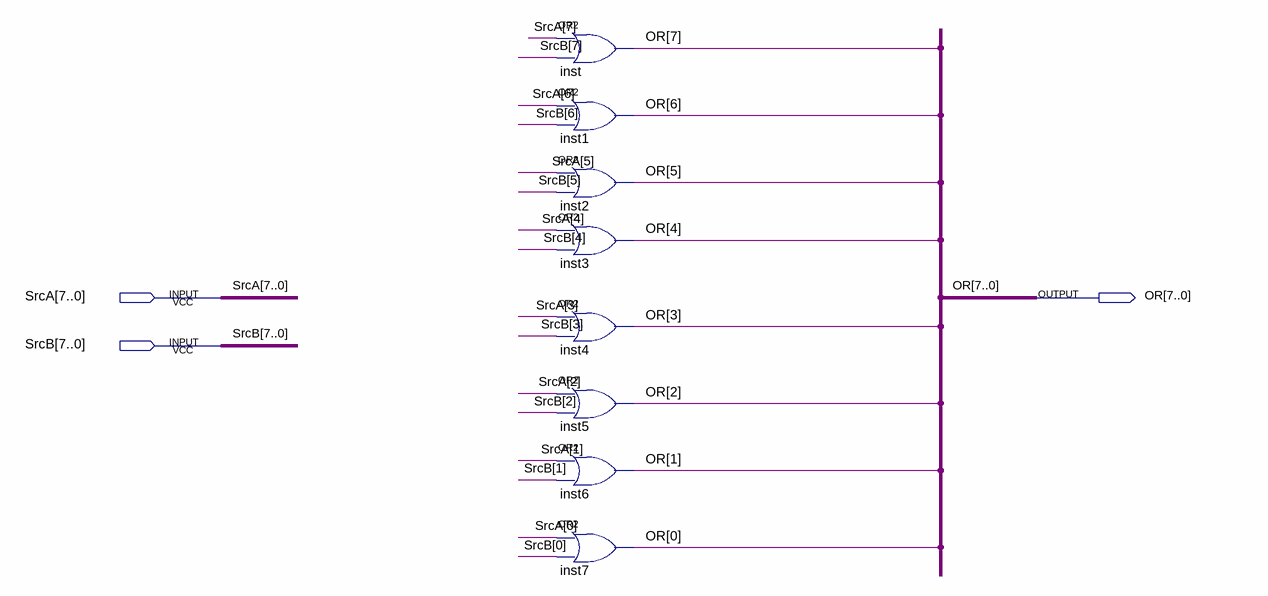
[diagram p0: schematic sheet]
// Quartus schematic ORFODA.bdf as structural Verilog: 8 symbols, 3 pins
module ORFODA (
  input  [7:0] SrcA,
  input  [7:0] SrcB,
  output [7:0] OR
);

  or inst (OR[7], SrcA[7], SrcB[7]);
  or inst1 (OR[6], SrcA[6], SrcB[6]);
  or inst2 (OR[5], SrcA[5], SrcB[5]);
  or inst3 (OR[4], SrcA[4], SrcB[4]);
  or inst4 (OR[3], SrcA[3], SrcB[3]);
  or inst5 (OR[2], SrcA[2], SrcB[2]);
  or inst6 (OR[1], SrcA[1], SrcB[1]);
  or inst7 (OR[0], SrcA[0], SrcB[0]);
endmodule
